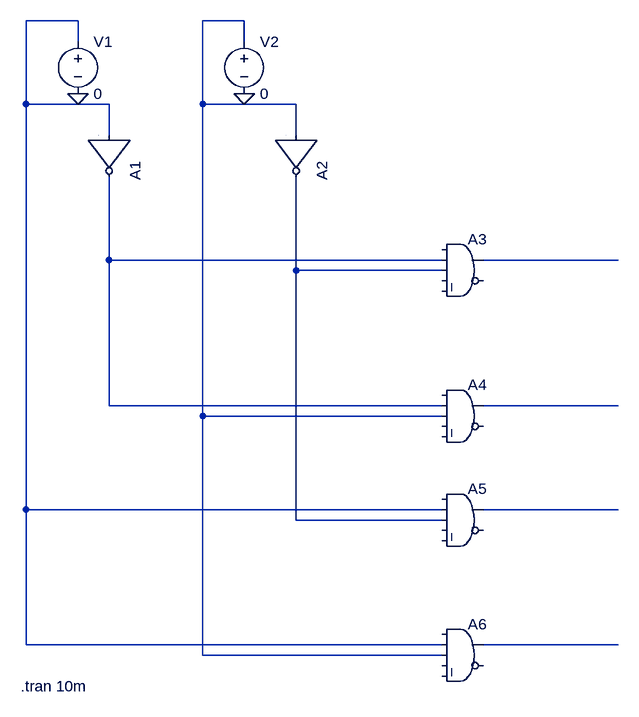
[diagram p0: schematic decoder.asc]
decoder.asc, the LTspice schematic file:
Version 4.1
SHEET 1 880 680
WIRE -336 -448 -416 -448
WIRE -80 -448 -144 -448
WIRE -336 -416 -336 -448
WIRE -80 -416 -80 -448
WIRE -416 -320 -416 -448
WIRE -288 -320 -416 -320
WIRE -144 -320 -144 -448
WIRE 0 -320 -144 -320
WIRE -288 -272 -288 -320
WIRE 0 -272 0 -320
WIRE -288 -80 -288 -208
WIRE 224 -80 -288 -80
WIRE 496 -80 288 -80
WIRE 0 -64 0 -208
WIRE 224 -64 0 -64
WIRE -288 144 -288 -80
WIRE 224 144 -288 144
WIRE 496 144 288 144
WIRE -144 160 -144 -320
WIRE 224 160 -144 160
WIRE -416 304 -416 -320
WIRE 224 304 -416 304
WIRE 496 304 288 304
WIRE 0 320 0 -64
WIRE 224 320 0 320
WIRE -416 512 -416 304
WIRE 224 512 -416 512
WIRE 496 512 288 512
WIRE -144 528 -144 160
WIRE 224 528 -144 528
FLAG -336 -336 0
FLAG -80 -336 0
SYMBOL voltage -336 -432 R0
WINDOW 123 0 0 Left 0
WINDOW 39 0 0 Left 0
SYMATTR InstName V1
SYMATTR Value 0
SYMBOL voltage -80 -432 R0
WINDOW 123 0 0 Left 0
WINDOW 39 0 0 Left 0
SYMATTR InstName V2
SYMATTR Value 0
SYMBOL Digital\\inv -224 -272 R90
SYMATTR InstName A1
SYMBOL Digital\\inv 64 -272 R90
SYMATTR InstName A2
SYMBOL Digital\\and 256 -128 R0
SYMATTR InstName A3
SYMBOL Digital\\and 256 96 R0
SYMATTR InstName A4
SYMBOL Digital\\and 256 256 R0
SYMATTR InstName A5
SYMBOL Digital\\and 256 464 R0
SYMATTR InstName A6
TEXT -424 576 Left 2 !.tran 10m

The netlist it stands for:
* decoder.asc
V1 N001 0 0
V2 N002 0 0
A1 N001 0 0 0 0 N003 0 0 BUF
A2 N002 0 0 0 0 N005 0 0 BUF
A3 0 N003 N005 0 0 0 N004 0 AND
A4 0 N003 N002 0 0 0 N006 0 AND
A5 0 N001 N005 0 0 0 N007 0 AND
A6 0 N001 N002 0 0 0 N008 0 AND
.tran 10m
.backanno
.end